# Altium schematic sheet YarnControl_motor_v1.2.SchDoc
size A2
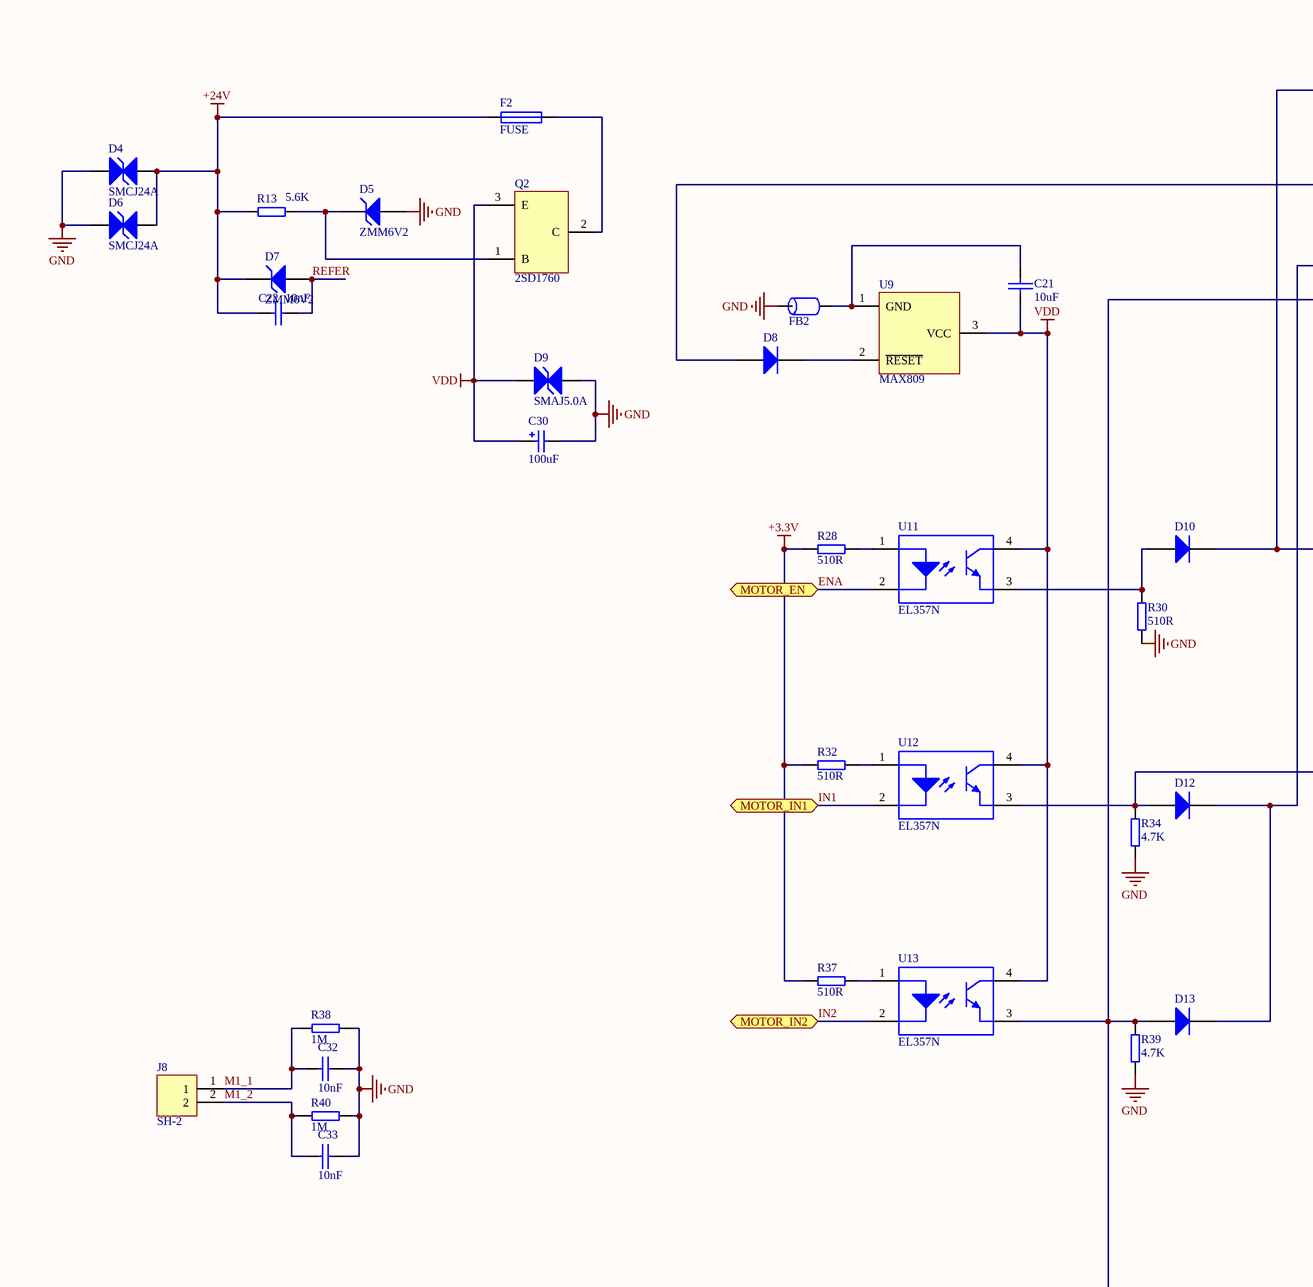
[diagram p0: YarnControl_motor_v1.2.SchDoc, left]
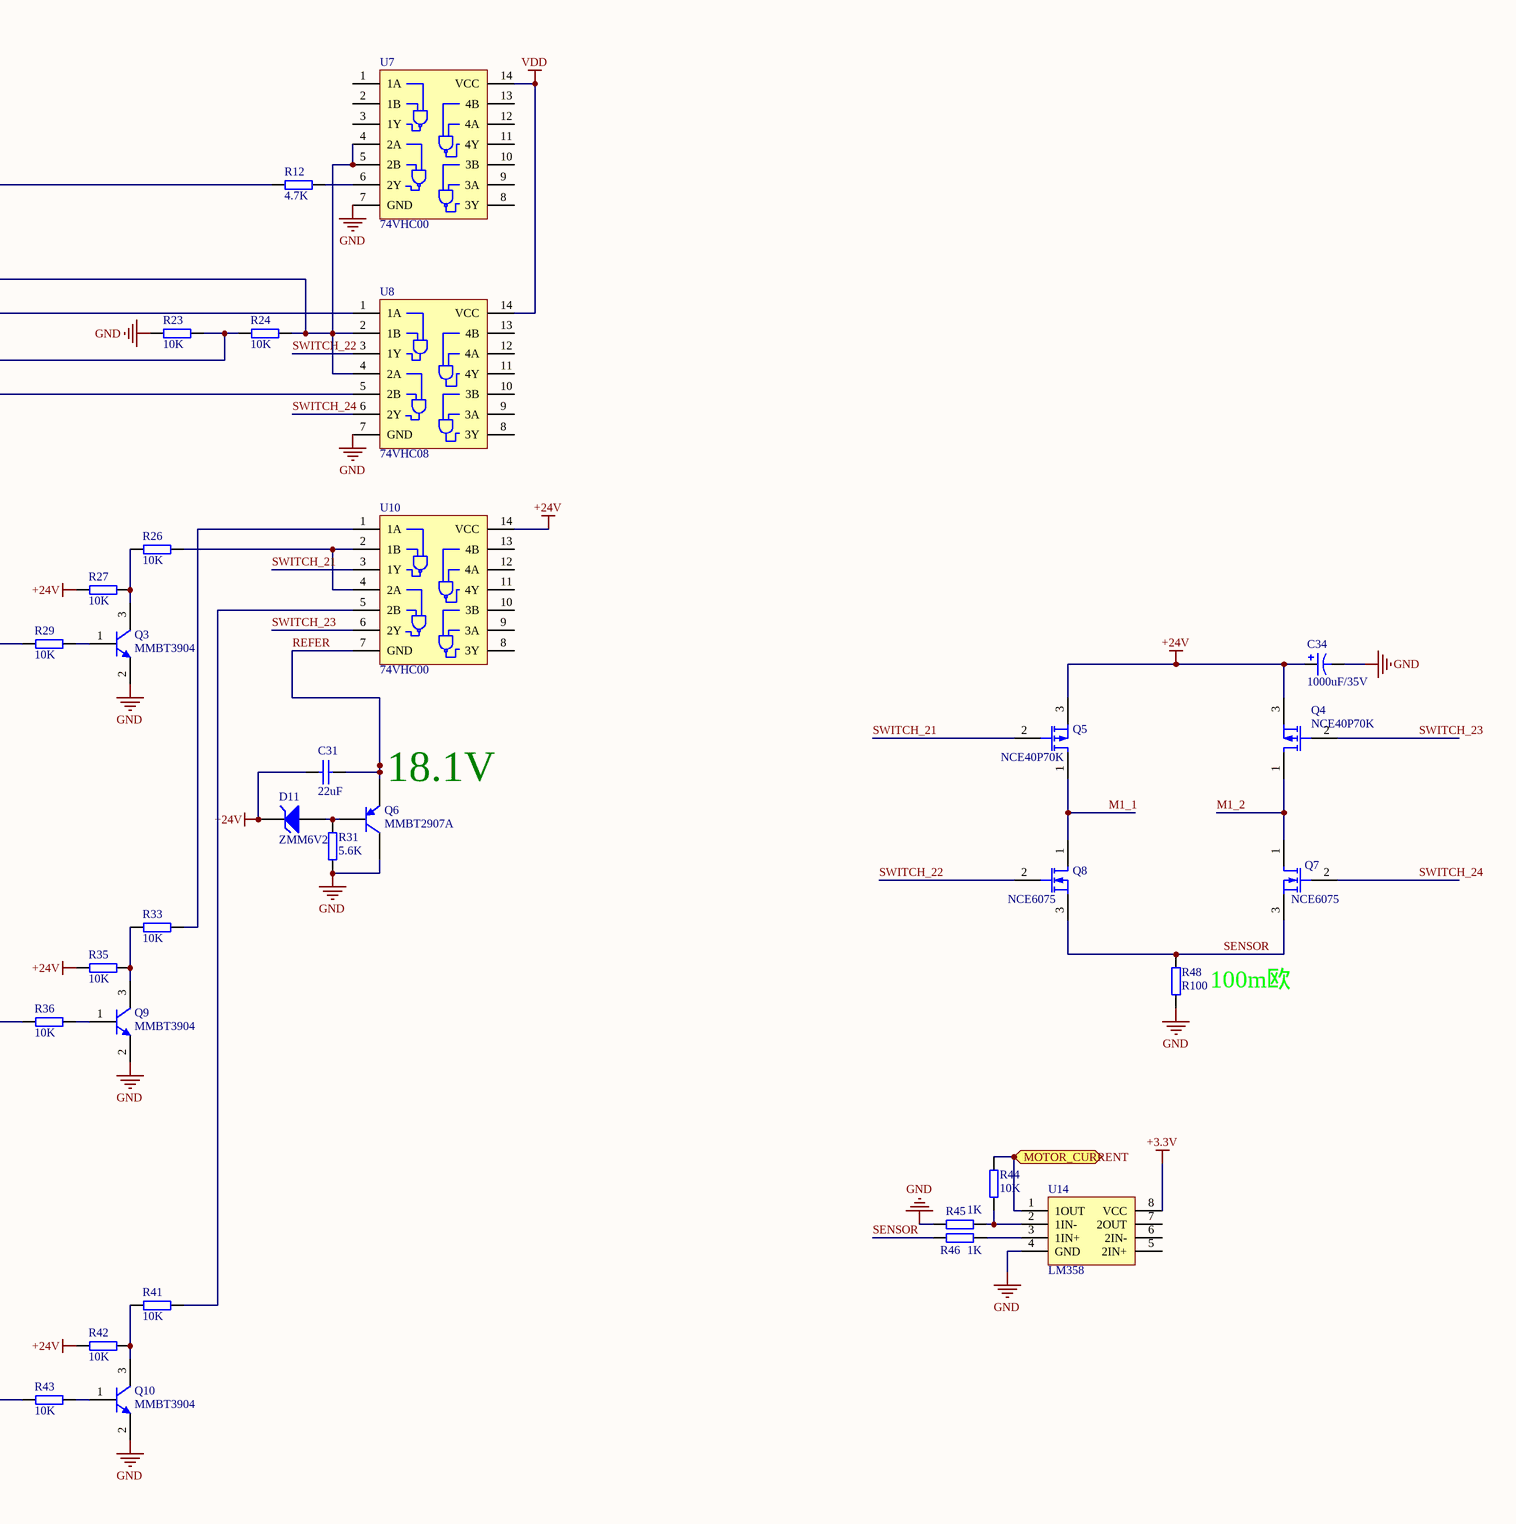
[diagram p1: YarnControl_motor_v1.2.SchDoc, right]

## Parts
C21  10uF  [0805]
C22  10nF  [0805]
C30  100uF  [CA6032-C]
C31  22uF  [0805]
C32  10nF  [0805]
C33  10nF  [0805]
C34  1000uF/35V  [CAP-5mm]
D4  SMCJ24A  [DO-214AA/SMB]
D5  ZMM6V2  [DIDODE_LL-34]
D6  SMCJ24A  [DO-214AA/SMB]
D7  ZMM6V2  [DIDODE_LL-34]
D8  1N4148  [DIDODE_LL-34]  (value not drawn)
D9  SMAJ5.0A  [Diode_TP2]
D10  1N4148  [DIDODE_LL-34]  (value not drawn)
D11  ZMM6V2  [DIDODE_LL-34]
D12  1N4148  [DIDODE_LL-34]  (value not drawn)
D13  1N4148  [DIDODE_LL-34]  (value not drawn)
F2  FUSE  [1206]
FB2  FERRITE  [0805]  (value not drawn)
J8  SH-2  [CH3.96-2P]
Q2  2SD1760  [TO-252-2L]
Q3  MMBT3904  [SOT-23]
Q4  NCE40P70K  [TO-252]
Q5  NCE40P70K  [TO-252]
Q6  MMBT2907A  [901X_SOT-23]
Q7  NCE6075  [TO-252]
Q8  NCE6075  [TO-252]
Q9  MMBT3904  [SOT-23]
Q10  MMBT3904  [SOT-23]
R12  4.7K  [0805]
R13  5.6K  [0805]
R23  10K  [0805]
R24  10K  [0805]
R26  10K  [0805]
R27  10K  [0805]
R28  510R  [0805]
R29  10K  [0805]
R30  510R  [0805]
R31  5.6K  [0805]
R32  510R  [0805]
R33  10K  [0805]
R34  4.7K  [0805]
R35  10K  [0805]
R36  10K  [0805]
R37  510R  [0805]
R38  1M  [0805]
R39  4.7K  [0805]
R40  1M  [0805]
R41  10K  [0805]
R42  10K  [0805]
R43  10K  [0805]
R44  10K  [0805]
R45  1K  [0805]
R46  1K  [0805]
R48  R100  [2512]
U7  74VHC00  [SO-14]
U8  74VHC08  [SO-14]
U9  MAX809  [SOT-23]
U10  74VHC00  [SO-14]
U11  EL357N  [EL357N]
U12  EL357N  [EL357N]
U13  EL357N  [EL357N]
U14  LM358  [SO-8]

## Ports
MOTOR_CURRENT, MOTOR_EN, MOTOR_IN1, MOTOR_IN2

## Nets
+3.3V: R28.1 R32.1 R37.1 U14.8(VCC)
+24V: C22.1 C31.2 C34.1 D4.1(A) D6.1(A) D7.2(K) D11.2(K) F2.2 Q4.3(S) Q5.3(S) R13.1 R27.1 R35.1 R42.1 U10.14(VCC)
GND: C30.2 C32.1 C33.1 C34.2 D4.2(K) D5.1(A) D6.2(K) D9.1(A) FB2.2 Q3.2(E) Q6.1(C) Q9.2(E) Q10.2(E) R23.1 R30.1 R31.1 R34.1 R38.2 R39.1 R40.2 R45.2 R48.1 U7.7(GND) U8.7(GND) U14.4(GND)
VDD: C21.1 C30.1 D9.2(K) Q2.3(E) U7.14(VCC) U8.14(VCC) U9.3(VCC) U11.4(C) U12.4(C) U13.4(C)
ENA: U11.2(Vin-) ; port MOTOR_EN
IN1: U12.2(Vin-) ; port MOTOR_IN1
IN2: U13.2(Vin-) ; port MOTOR_IN2
M1_1: C32.2 J8.1 Q5.1(D) Q8.1(D) R38.1
M1_2: C33.2 J8.2 Q4.1(D) Q7.1(D) R40.1
MOTOR_CURRENT: R44.1 U14.1(1OUT) ; port MOTOR_CURRENT
REFER: C22.2 C31.1 D7.1(A) Q6.3(E) U10.7(GND)
SENSOR: Q7.3(S) Q8.3(S) R46.2 R48.2
SWITCH_21: Q5.2(G) U10.3(1Y)
SWITCH_22: Q8.2(G) U8.3(1Y)
SWITCH_23: Q4.2(G) U10.6(2Y)
SWITCH_24: Q7.2(G) U8.6(2Y)
NetC21_2: C21.2 FB2.1 U9.1(GND)
NetD5_2: D5.2(K) Q2.1(B) R13.2
NetD8_1: D8.1(A) R24.2 U7.4(2A) U7.5(2B) U8.2(1B) U8.4(2A)
NetD8_2: D8.2(K) U9.2(~{RESET})
NetD10_1: D10.1(A) R30.2 U11.3(E)
NetD10_2: D10.2(K) R12.1 R29.1
NetD11_1: D11.1(A) Q6.2(B) R31.2
NetD12_1: D12.1(A) R34.2 R36.1 U8.1(1A) U12.3(E)
NetD12_2: D12.2(K) D13.2(K) R23.2 R24.1
NetD13_1: D13.1(A) R39.2 R43.1 U8.5(2B) U13.3(E)
NetF2_1: F2.1 Q2.2(C)
NetQ3_1: Q3.1(B) R29.2
NetQ3_3: Q3.3(C) R26.1 R27.2
NetQ9_1: Q9.1(B) R36.2
NetQ9_3: Q9.3(C) R33.1 R35.2
NetQ10_1: Q10.1(B) R43.2
NetQ10_3: Q10.3(C) R41.1 R42.2
NetR12_2: R12.2 U7.6(2Y)
NetR26_2: R26.2 U10.2(1B) U10.4(2A)
NetR28_2: R28.2 U11.1(Vin+)
NetR32_2: R32.2 U12.1(Vin+)
NetR33_2: R33.2 U10.1(1A)
NetR37_2: R37.2 U13.1(Vin+)
NetR41_2: R41.2 U10.5(2B)
NetR44_2: R44.2 R45.1 U14.2(1IN-)
NetR46_1: R46.1 U14.3(1IN+)

Not connected (* = marked no-connect by the designer): U7 1(1A) 2(1B) 3(1Y) 8(3Y) 9(3A) 10(3B) 11(4Y) 12(4A) 13(4B); U8 8(3Y) 9(3A) 10(3B) 11(4Y) 12(4A) 13(4B); U10 8(3Y) 9(3A) 10(3B) 11(4Y) 12(4A) 13(4B); U14 5(2IN+) 6(2IN-) 7(2OUT)

## Notes on the sheet
- (near Q6) 18.1V
- (near R48) 100m欧

## Library data of the parts
C21 C22 C31-C33 = CAP: 电容
C30 = CapAEC*4
C34 = Cap Pol1: Polarized Capacitor (Radial); Published: 8-Jun-2000; LatestRevisionDate: 17-Jul-2002; LatestRevisionNote: Re-released for DXP Platform.; PackageReference: RB7.6-15; Publisher: Altium Limited
D4 D6 D9 = TVS: Published: 8-Jun-2000; LatestRevisionDate: 17-Jul-2002; LatestRevisionNote: Re-released for DXP Platform.; PackageReference: DIODE-0.7; Publisher: Altium Limited
D5 D7 D11 = D Zener: Zener Diode; Published: 8-Jun-2000; LatestRevisionDate: 17-Jul-2002; LatestRevisionNote: Re-released for DXP Platform.; PackageReference: DIODE-0.7; Publisher: Altium Limited
D8 D10 D12 D13 = Diode: Default Diode; Published: 8-Jun-2000; LatestRevisionDate: 17-Jul-2002; LatestRevisionNote: Re-released for DXP Platform.; PackageVersion: Sep-1996; PackageReference: SMC; Publisher: Altium Limited; Code_JEDEC: DO-214-AB
F2 = FUSE: 保险丝
Q3 Q9 Q10 = S8050
Q4 Q5 = MOSFET-P: P-Channel MOSFET; Published: 8-Jun-2000; LatestRevisionDate: 17-Jul-2002; LatestRevisionNote: Re-released for DXP Platform.; PackageVersion: 1995/1996; PackageReference: E3; Publisher: Altium Limited
Q6 = PNP
Q7 Q8 = MOSFET-N: N-Channel MOSFET; Published: 8-Jun-2000; LatestRevisionDate: 17-Jul-2002; LatestRevisionNote: Re-released for DXP Platform.; PackageVersion: 1995/1996; PackageReference: E3; Publisher: Altium Limited
R12 R13 R23 R24 R26-R46 R48 = RES: 电阻
U8 = 74HC08
U11-U13 = TLP521